# Altium schematic sheet main.SchDoc
size A3; SheetNumber: 1; SheetTotal: 15
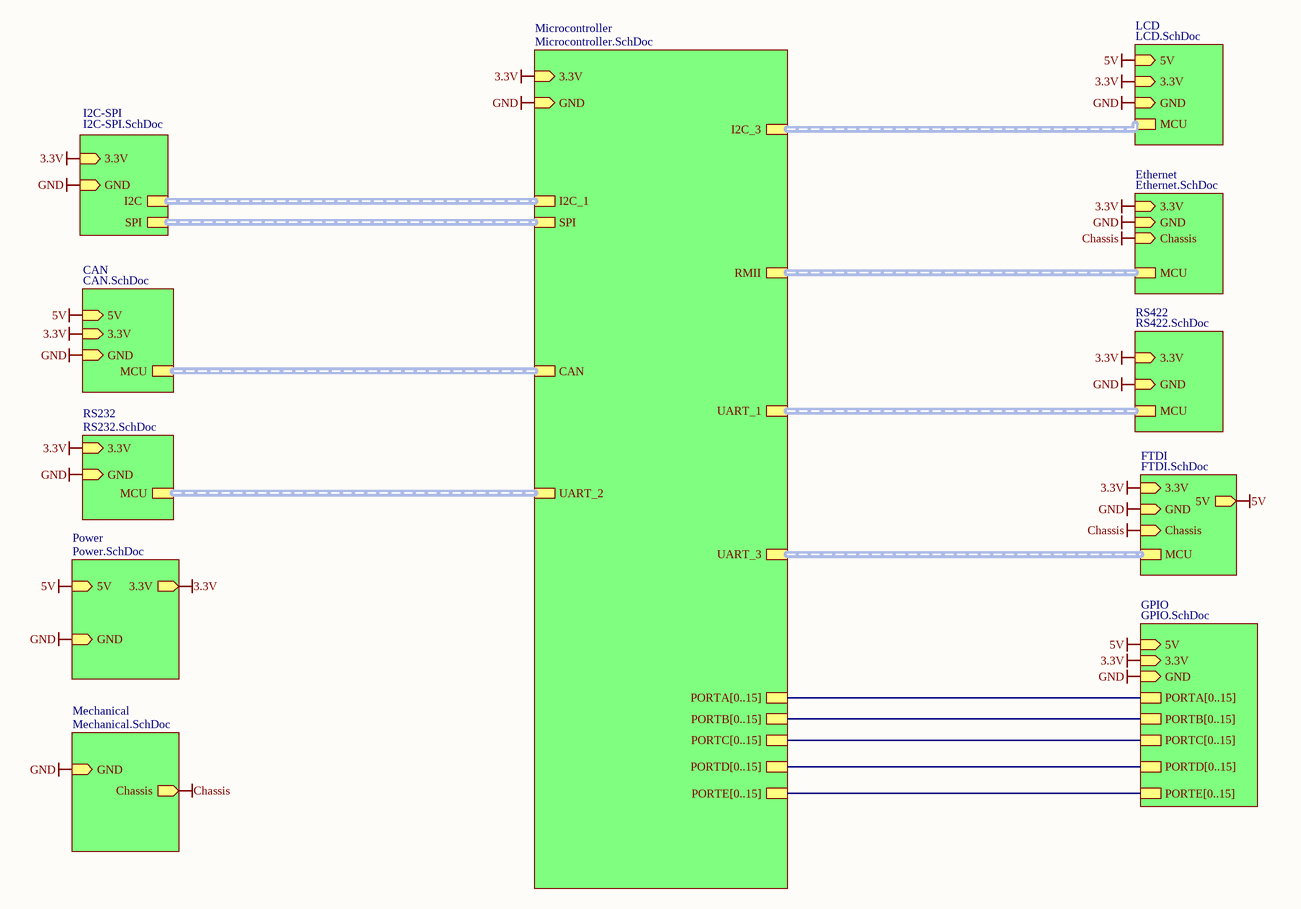
[diagram p0: main.SchDoc]

## Sub-sheets
CAN = CAN.SchDoc: 3.3V (in), GND (in), MCU (harness CAN), 5V (in)
Ethernet = Ethernet.SchDoc: 3.3V (in), GND (in), MCU (harness RMII), Chassis (in)
FTDI = FTDI.SchDoc: 3.3V (in), GND (in), MCU (harness UART), 5V (out), Chassis (in)
GPIO = GPIO.SchDoc: 3.3V (in), GND (in), PORTA[0..15], PORTB[0..15], PORTC[0..15], PORTD[0..15], PORTE[0..15], 5V (in)
I2C-SPI = I2C-SPI.SchDoc: 3.3V (in), GND (in), SPI (harness SPI), I2C (harness I2C)
LCD = LCD.SchDoc: 3.3V (in), GND (in), MCU (harness I2C), 5V (in)
Mechanical = Mechanical.SchDoc: Chassis (out), GND (in)
Microcontroller = Microcontroller.SchDoc: 3.3V (in), GND (in), CAN (harness CAN), UART_2 (harness UART), SPI (harness SPI), I2C_3 (harness I2C), RMII (harness RMII), UART_1 (harness UART), UART_3 (harness UART), I2C_1 (harness I2C), PORTA[0..15], PORTB[0..15], PORTC[0..15], PORTD[0..15], PORTE[0..15]
Power = Power.SchDoc: 5V (in), GND (in), 3.3V (out)
RS232 = RS232.SchDoc: 3.3V (in), GND (in), MCU (harness UART)
RS422 = RS422.SchDoc: 3.3V (in), GND (in), MCU (harness UART)

## Nets
3.3V: sheet CAN/3.3V, sheet RS232/3.3V, sheet Power/3.3V, sheet Microcontroller/3.3V, sheet LCD/3.3V, sheet Ethernet/3.3V, sheet RS422/3.3V, sheet FTDI/3.3V, sheet GPIO/3.3V, sheet I2C-SPI/3.3V
5V: sheet CAN/5V, sheet Power/5V, sheet LCD/5V, sheet FTDI/5V, sheet GPIO/5V
Chassis: sheet Ethernet/Chassis, sheet FTDI/Chassis, sheet Mechanical/Chassis
GND: sheet CAN/GND, sheet RS232/GND, sheet Power/GND, sheet Microcontroller/GND, sheet LCD/GND, sheet Ethernet/GND, sheet RS422/GND, sheet FTDI/GND, sheet GPIO/GND, sheet Mechanical/GND, sheet I2C-SPI/GND

## Buses and harness runs
bus sheet GPIO/PORTA[0..15] = sheet Microcontroller/PORTA[0..15]
bus sheet GPIO/PORTB[0..15] = sheet Microcontroller/PORTB[0..15]
bus sheet GPIO/PORTC[0..15] = sheet Microcontroller/PORTC[0..15]
bus sheet GPIO/PORTD[0..15] = sheet Microcontroller/PORTD[0..15]
bus sheet GPIO/PORTE[0..15] = sheet Microcontroller/PORTE[0..15]
harness sheet CAN/MCU = sheet Microcontroller/CAN
harness sheet Ethernet/MCU = sheet Microcontroller/RMII
harness sheet FTDI/MCU = sheet Microcontroller/UART_3
harness sheet I2C-SPI/I2C = sheet Microcontroller/I2C_1
harness sheet I2C-SPI/SPI = sheet Microcontroller/SPI
harness sheet LCD/MCU = sheet Microcontroller/I2C_3
harness sheet Microcontroller/UART_1 = sheet RS422/MCU
harness sheet Microcontroller/UART_2 = sheet RS232/MCU